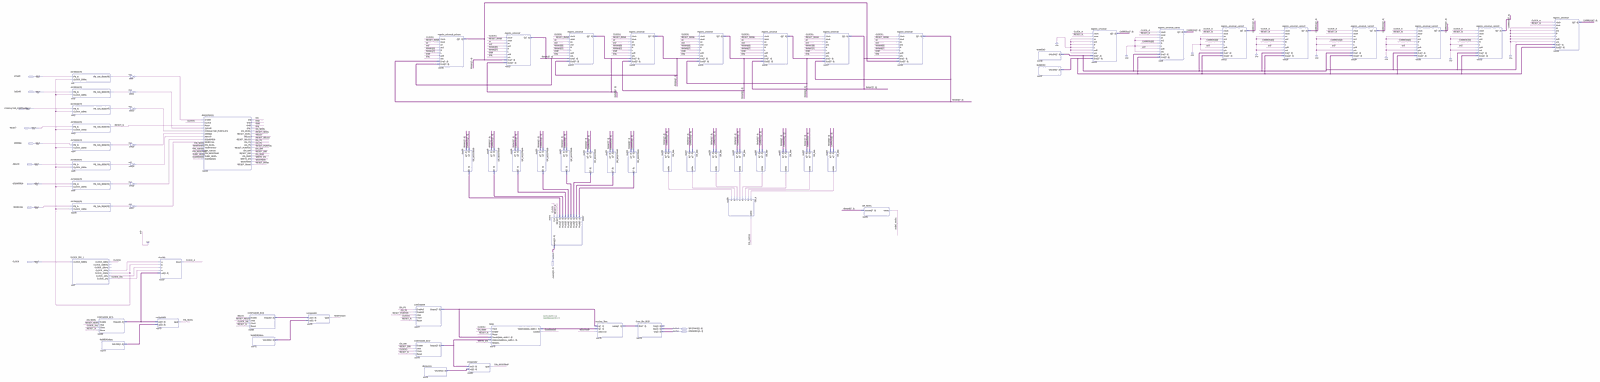
[diagram p0: schematic sheet, whole]
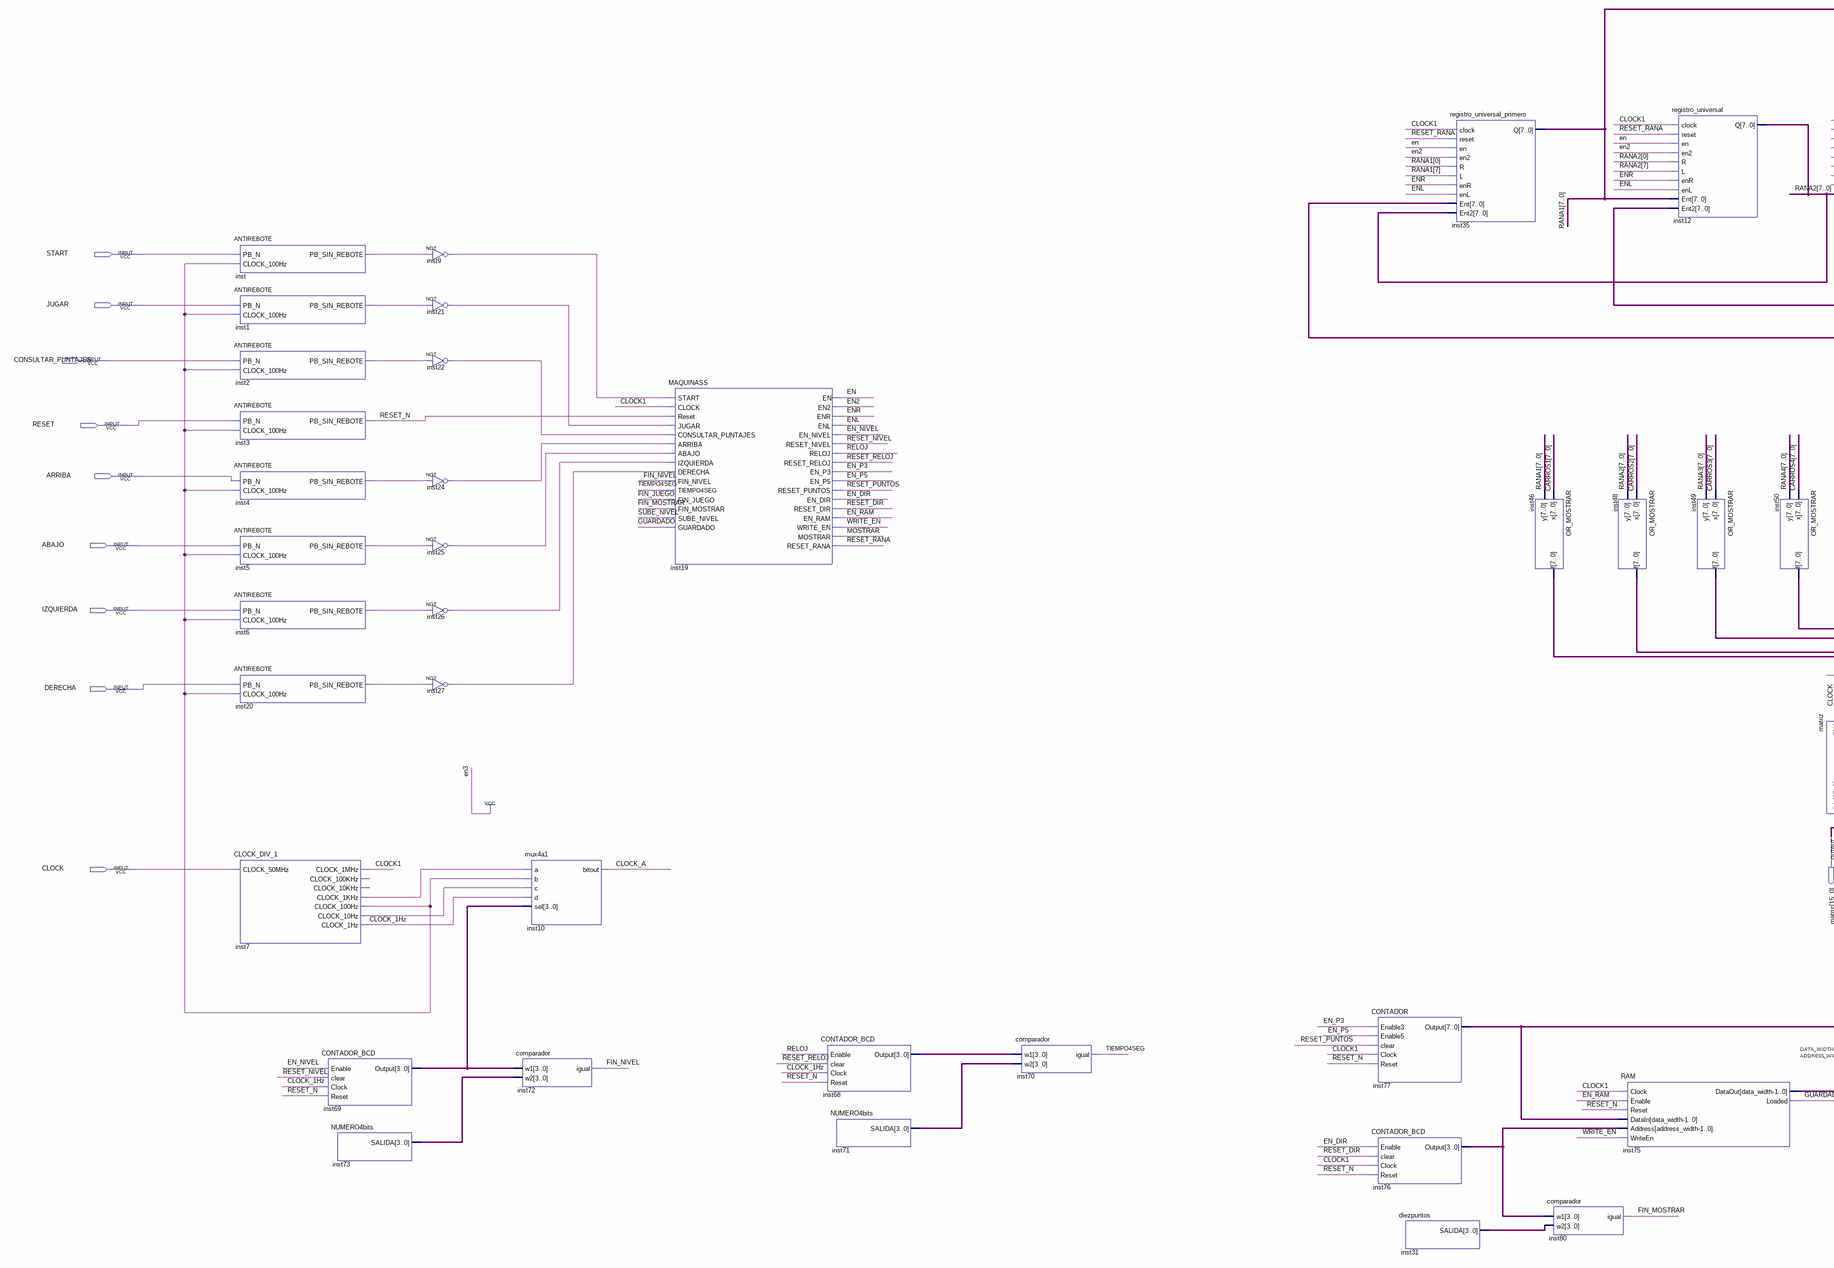
[diagram p1: schematic sheet, left part]
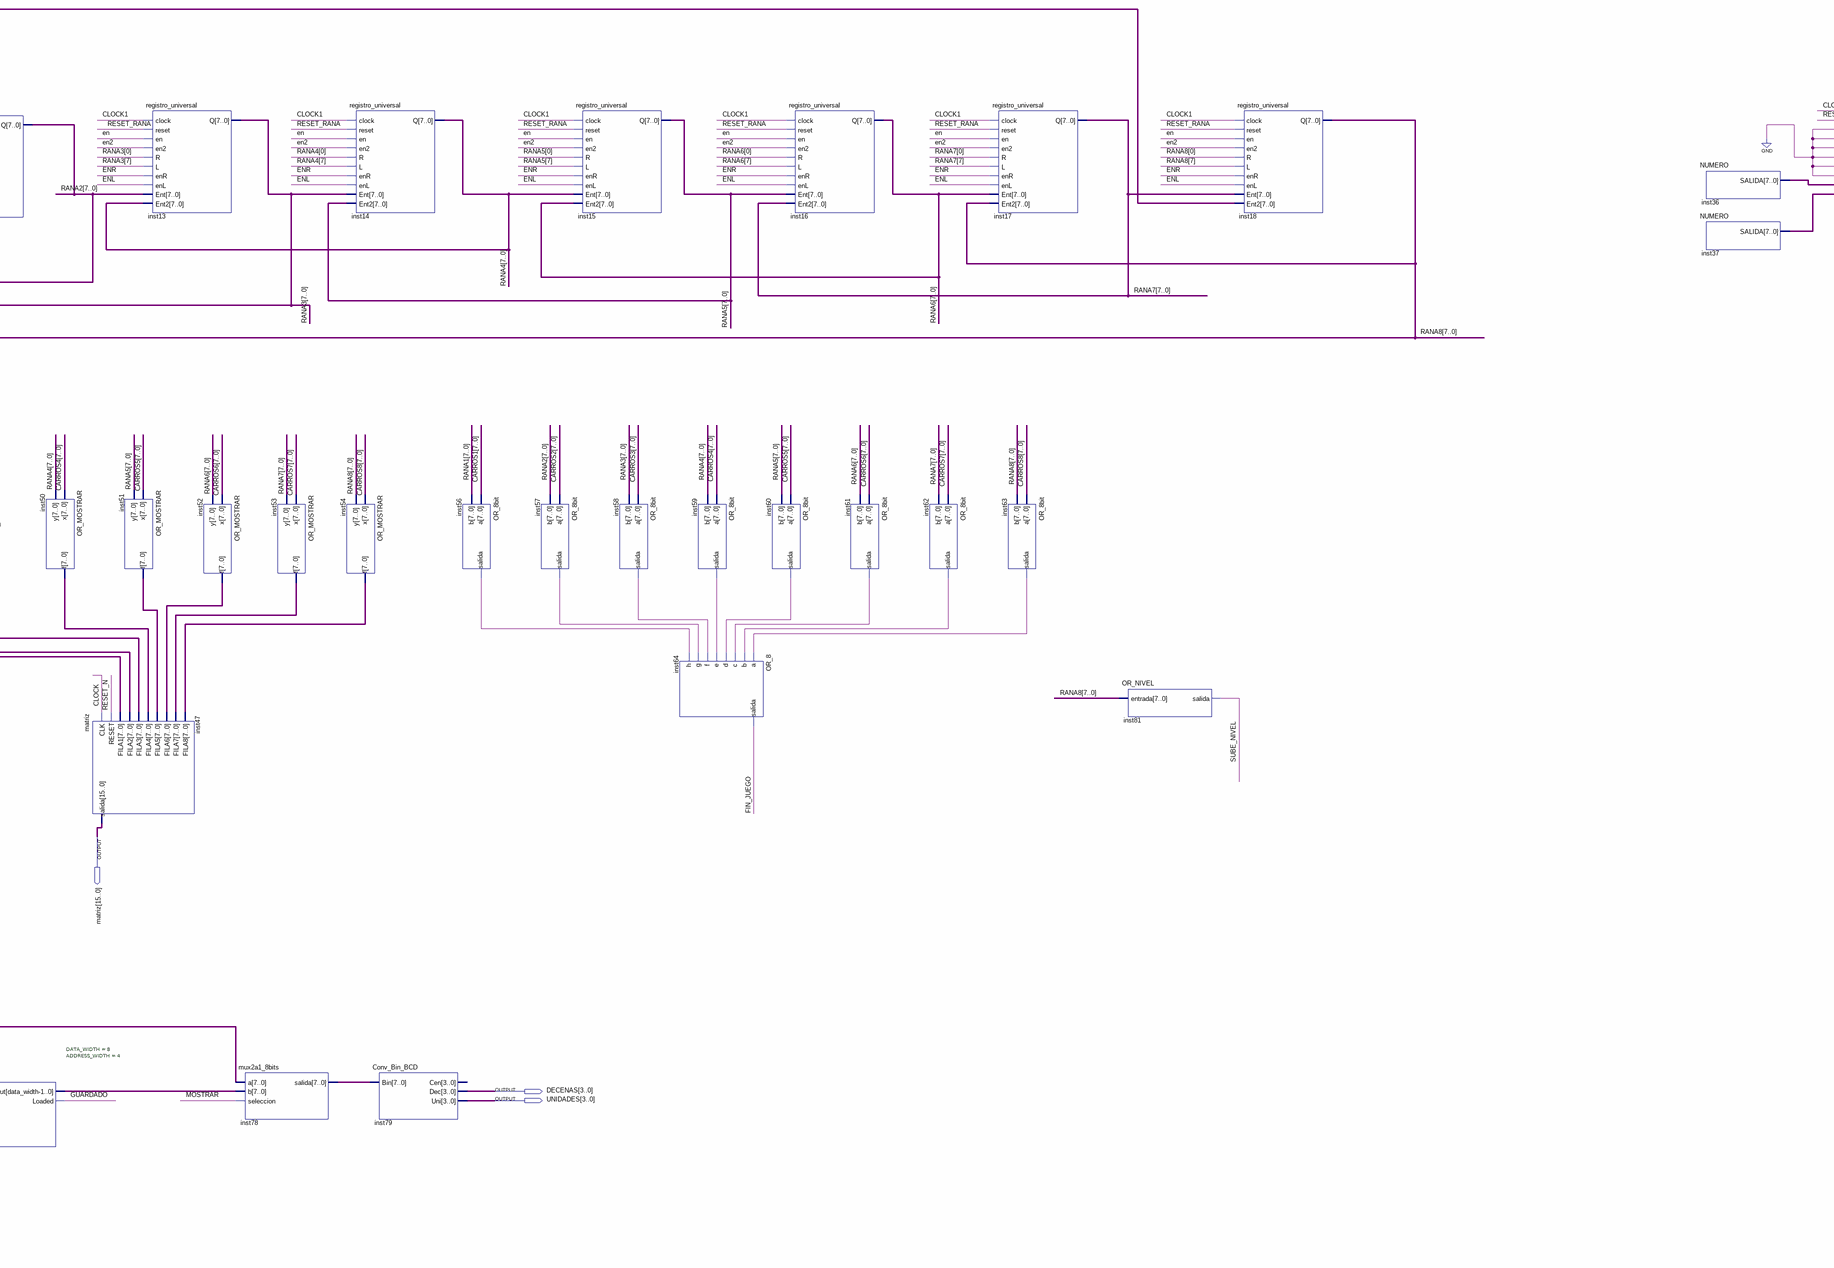
[diagram p2: schematic sheet, centre part]
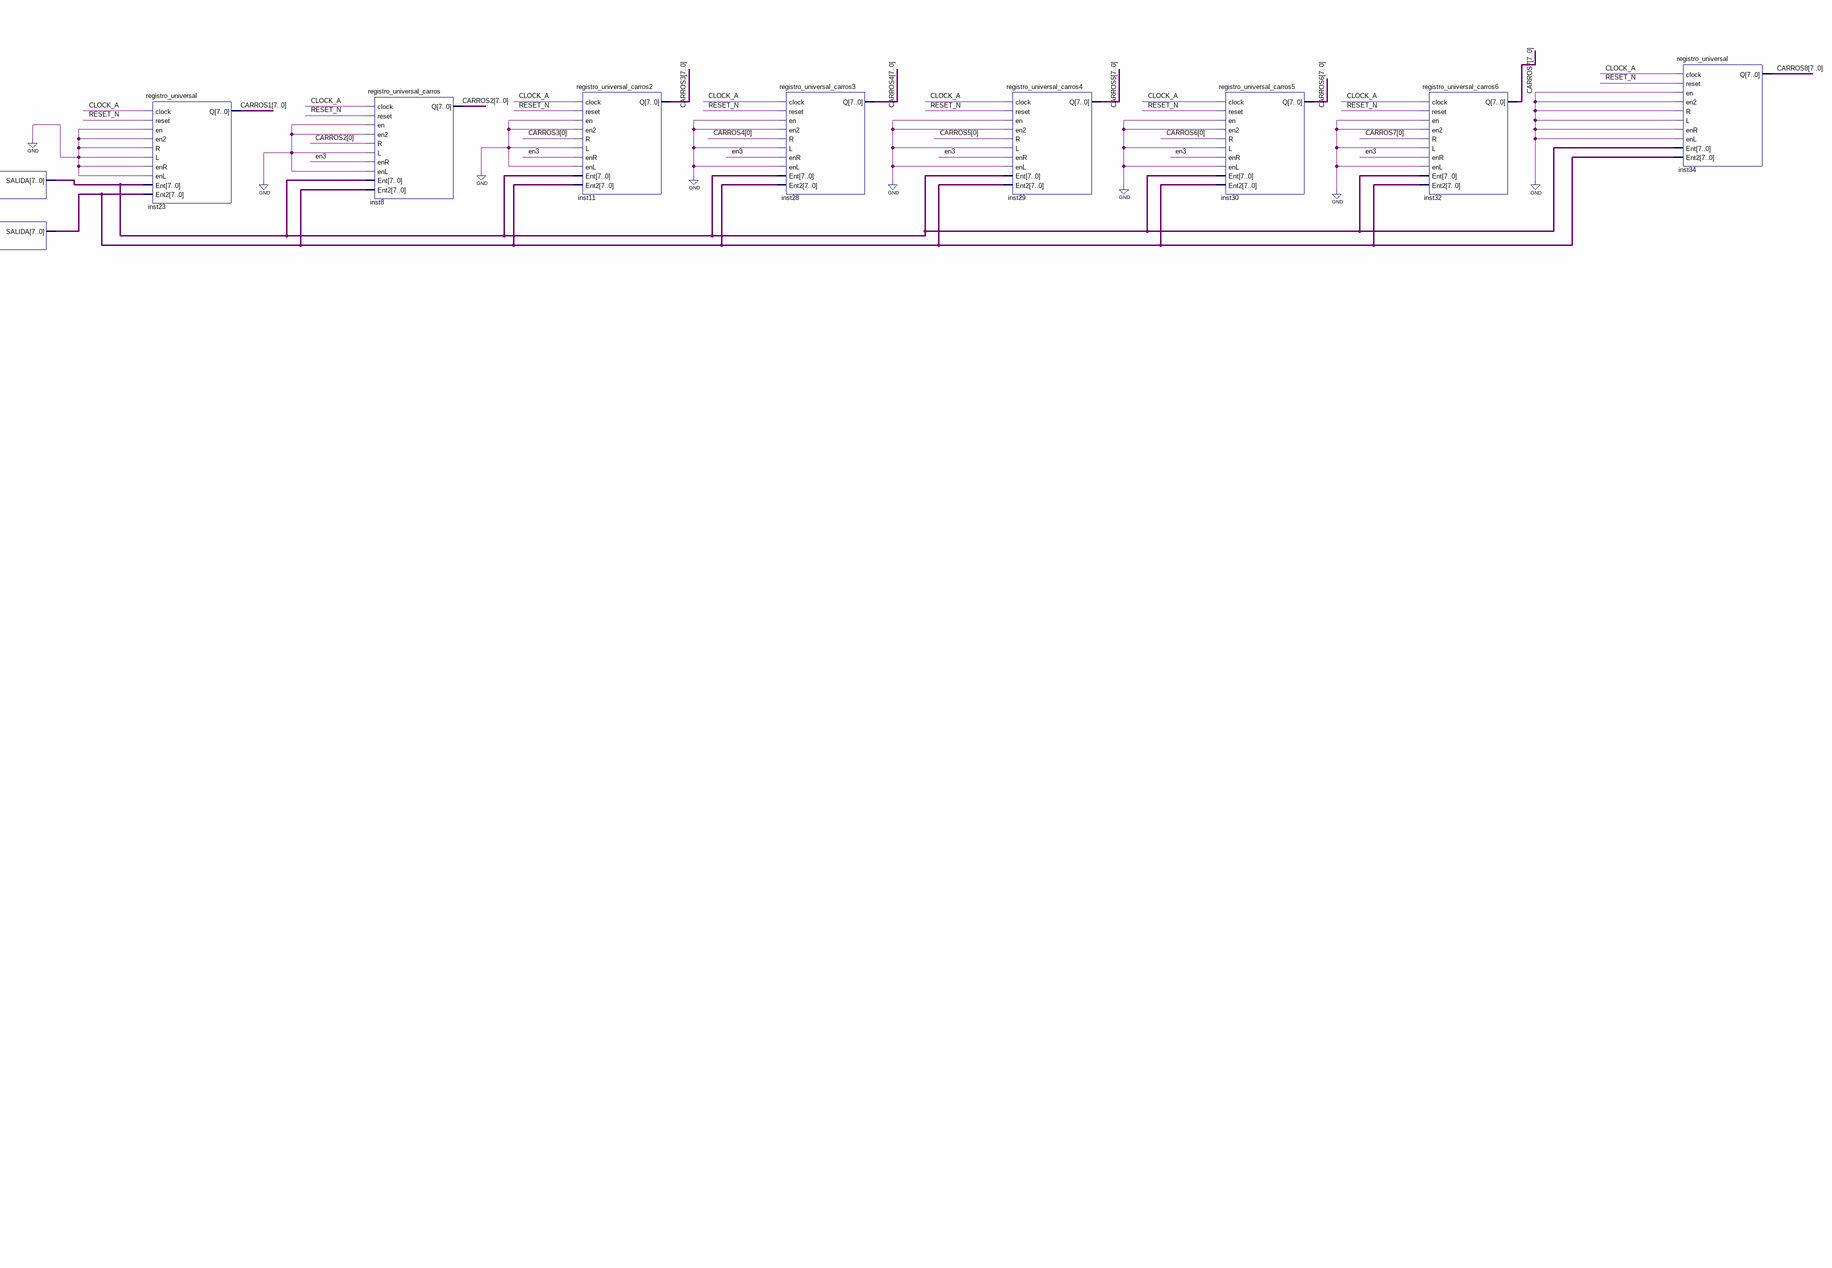
[diagram p3: schematic sheet, right part]
// Quartus schematic brick_games.bdf as structural Verilog: 68 symbols, 12 pins
module brick_games (
  input  START,
  input  JUGAR,
  input  CONSULTAR_PUNTAJES,
  input  RESET,
  input  ARRIBA,
  input  ABAJO,
  input  IZQUIERDA,
  input  DERECHA,
  input  CLOCK,
  output [15:0] matriz,
  output [3:0] DECENAS,
  output [3:0] UNIDADES
);

  wire CLOCK1, CLOCK_1Hz, CLOCK_A, en, en2, EN_DIR, EN_NIVEL, EN_P3, EN_P5, EN_RAM, ENL, ENR, FIN_JUEGO,
       FIN_MOSTRAR, FIN_NIVEL, GUARDADO, inst1_pb_sin_rebote, inst2_pb_sin_rebote, inst4_pb_sin_rebote,
       inst5_pb_sin_rebote, inst6_pb_sin_rebote, inst7_clock_1khz, inst7_clock_10hz, inst7_clock_100hz,
       inst9_out, inst20_pb_sin_rebote, inst21_out, inst22_out, inst24_out, inst25_out, inst26_out,
       inst27_out, inst56_salida, inst57_salida, inst58_salida, inst59_salida, inst60_salida, inst61_salida,
       inst62_salida, inst63_salida, inst_pb_sin_rebote, MOSTRAR, RELOJ, RESET_DIR, RESET_N, RESET_NIVEL,
       RESET_PUNTOS, RESET_RANA, RESET_RELOJ, SUBE_NIVEL, TIEMPO4SEG, WRITE_EN;
  wire [3:0] inst31_salida, inst68_output, inst69_output, inst71_salida, inst73_salida, inst76_output;
  wire [7:0] CARROS1, CARROS2, CARROS3, CARROS4, CARROS5, CARROS6, CARROS7, CARROS8, inst36_salida,
       inst37_salida, inst46_f, inst48_f, inst49_f, inst50_f, inst51_f, inst52_f, inst53_f, inst54_f,
       inst75_dataout, inst77_output, inst78_salida, RANA1, RANA2, RANA3, RANA4, RANA5, RANA6, RANA7, RANA8;

  ANTIREBOTE inst (.PB_N(START), .CLOCK_100Hz(inst7_clock_100hz), .PB_SIN_REBOTE(inst_pb_sin_rebote));
  ANTIREBOTE inst1 (.PB_N(JUGAR), .CLOCK_100Hz(inst7_clock_100hz), .PB_SIN_REBOTE(inst1_pb_sin_rebote));
  ANTIREBOTE inst2 (.PB_N(CONSULTAR_PUNTAJES), .CLOCK_100Hz(inst7_clock_100hz), .PB_SIN_REBOTE(inst2_pb_sin_rebote));
  ANTIREBOTE inst3 (.PB_N(RESET), .CLOCK_100Hz(inst7_clock_100hz), .PB_SIN_REBOTE(RESET_N));
  ANTIREBOTE inst4 (.PB_N(ARRIBA), .CLOCK_100Hz(inst7_clock_100hz), .PB_SIN_REBOTE(inst4_pb_sin_rebote));
  ANTIREBOTE inst5 (.PB_N(ABAJO), .CLOCK_100Hz(inst7_clock_100hz), .PB_SIN_REBOTE(inst5_pb_sin_rebote));
  ANTIREBOTE inst6 (.PB_N(IZQUIERDA), .CLOCK_100Hz(inst7_clock_100hz), .PB_SIN_REBOTE(inst6_pb_sin_rebote));
  ANTIREBOTE inst20 (.PB_N(DERECHA), .CLOCK_100Hz(inst7_clock_100hz), .PB_SIN_REBOTE(inst20_pb_sin_rebote));
  CLOCK_DIV_1 inst7 (
    .CLOCK_50MHz(CLOCK), .CLOCK_1MHz(CLOCK1), .CLOCK_1KHz(inst7_clock_1khz), .CLOCK_100Hz(inst7_clock_100hz),
    .CLOCK_10Hz(inst7_clock_10hz), .CLOCK_1Hz(CLOCK_1Hz));  // open: CLOCK_100KHz, CLOCK_10KHz
  CONTADOR_BCD inst69 (
    .Enable(EN_NIVEL), .clear(RESET_NIVEL), .Clock(CLOCK_1Hz), .Reset(RESET_N), .Output(inst69_output));
  NUMERO4bits inst73 (.SALIDA(inst73_salida));
  not inst9 (inst9_out, inst_pb_sin_rebote);
  not inst21 (inst21_out, inst1_pb_sin_rebote);
  not inst22 (inst22_out, inst2_pb_sin_rebote);
  not inst24 (inst24_out, inst4_pb_sin_rebote);
  not inst25 (inst25_out, inst5_pb_sin_rebote);
  not inst26 (inst26_out, inst6_pb_sin_rebote);
  not inst27 (inst27_out, inst20_pb_sin_rebote);
  mux4a1 inst10 (
    .a(inst7_clock_1khz), .b(inst7_clock_100hz), .c(inst7_clock_10hz), .d(CLOCK_1Hz), .sel(inst69_output),
    .bitout(CLOCK_A));
  comparador inst72 (.w1(inst69_output), .w2(inst73_salida), .igual(FIN_NIVEL));
  MAQUINASS inst19 (
    .START(inst9_out), .CLOCK(CLOCK1), .Reset(RESET_N), .JUGAR(inst21_out), .CONSULTAR_PUNTAJES(inst22_out),
    .ARRIBA(inst24_out), .ABAJO(inst25_out), .IZQUIERDA(inst26_out), .DERECHA(inst27_out),
    .FIN_NIVEL(FIN_NIVEL), .TIEMPO4SEG(TIEMPO4SEG), .FIN_JUEGO(FIN_JUEGO), .FIN_MOSTRAR(FIN_MOSTRAR),
    .SUBE_NIVEL(SUBE_NIVEL), .GUARDADO(GUARDADO), .EN(en), .EN2(en2), .ENR(ENR), .ENL(ENL),
    .EN_NIVEL(EN_NIVEL), .RESET_NIVEL(RESET_NIVEL), .RELOJ(RELOJ), .RESET_RELOJ(RESET_RELOJ), .EN_P3(EN_P3),
    .EN_P5(EN_P5), .RESET_PUNTOS(RESET_PUNTOS), .EN_DIR(EN_DIR), .RESET_DIR(RESET_DIR), .EN_RAM(EN_RAM),
    .WRITE_EN(WRITE_EN), .MOSTRAR(MOSTRAR), .RESET_RANA(RESET_RANA));
  CONTADOR_BCD inst68 (.Enable(RELOJ), .clear(RESET_RELOJ), .Clock(CLOCK_1Hz), .Reset(RESET_N), .Output(inst68_output));
  NUMERO4bits inst71 (.SALIDA(inst71_salida));
  comparador inst70 (.w1(inst68_output), .w2(inst71_salida), .igual(TIEMPO4SEG));
  CONTADOR inst77 (
    .Enable3(EN_P3), .Enable5(EN_P5), .clear(RESET_PUNTOS), .Clock(CLOCK1), .Reset(RESET_N),
    .Output(inst77_output));
  CONTADOR_BCD inst76 (.Enable(EN_DIR), .clear(RESET_DIR), .Clock(CLOCK1), .Reset(RESET_N), .Output(inst76_output));
  diezpuntos inst31 (.SALIDA(inst31_salida));
  registro_universal_primero inst35 (
    .clock(CLOCK1), .reset(RESET_RANA), .en(en), .en2(en2), .R(RANA1[0]), .L(RANA1[7]), .enR(ENR), .enL(ENL),
    .Ent(RANA8), .Ent2(RANA2), .Q(RANA1));
  OR_MOSTRAR inst46 (.x(CARROS1), .y(RANA1), .f(inst46_f));
  comparador inst80 (.w1(inst76_output), .w2(inst31_salida), .igual(FIN_MOSTRAR));
  OR_MOSTRAR inst48 (.x(CARROS2), .y(RANA2), .f(inst48_f));
  RAM #(.DATA_WIDTH(8), .ADDRESS_WIDTH(4)) inst75 (
    .Clock(CLOCK1), .Enable(EN_RAM), .Reset(RESET_N), .DataIn(inst77_output), .Address(inst76_output),
    .WriteEn(WRITE_EN), .DataOut(inst75_dataout), .Loaded(GUARDADO));
  registro_universal inst12 (
    .clock(CLOCK1), .reset(RESET_RANA), .en(en), .en2(en2), .R(RANA2[0]), .L(RANA2[7]), .enR(ENR), .enL(ENL),
    .Ent(RANA1), .Ent2(RANA3), .Q(RANA2));
  OR_MOSTRAR inst49 (.x(CARROS3), .y(RANA3), .f(inst49_f));
  OR_MOSTRAR inst50 (.x(CARROS4), .y(RANA4), .f(inst50_f));
  matriz inst47 (
    .CLK(CLOCK), .RESET(RESET_N), .FILA1(inst46_f), .FILA2(inst48_f), .FILA3(inst49_f), .FILA4(inst50_f),
    .FILA5(inst51_f), .FILA6(inst52_f), .FILA7(inst53_f), .FILA8(inst54_f), .salida(matriz));
  registro_universal inst13 (
    .clock(CLOCK1), .reset(RESET_RANA), .en(en), .en2(en2), .R(RANA3[0]), .L(RANA3[7]), .enR(ENR), .enL(ENL),
    .Ent(RANA2), .Ent2(RANA4), .Q(RANA3));
  OR_MOSTRAR inst51 (.x(CARROS5), .y(RANA5), .f(inst51_f));
  OR_MOSTRAR inst52 (.x(CARROS6), .y(RANA6), .f(inst52_f));
  mux2a1_8bits inst78 (.a(inst77_output), .b(inst75_dataout), .seleccion(MOSTRAR), .salida(inst78_salida));
  OR_MOSTRAR inst53 (.x(CARROS7), .y(RANA7), .f(inst53_f));
  registro_universal inst14 (
    .clock(CLOCK1), .reset(RESET_RANA), .en(en), .en2(en2), .R(RANA4[0]), .L(RANA4[7]), .enR(ENR), .enL(ENL),
    .Ent(RANA3), .Ent2(RANA5), .Q(RANA4));
  OR_MOSTRAR inst54 (.x(CARROS8), .y(RANA8), .f(inst54_f));
  Conv_Bin_BCD inst79 (.Bin(inst78_salida), .Dec(DECENAS), .Uni(UNIDADES));  // open: Cen
  OR_8bit inst56 (.a(CARROS1), .b(RANA1), .salida(inst56_salida));
  OR_8bit inst57 (.a(CARROS2), .b(RANA2), .salida(inst57_salida));
  registro_universal inst15 (
    .clock(CLOCK1), .reset(RESET_RANA), .en(en), .en2(en2), .R(RANA5[0]), .L(RANA5[7]), .enR(ENR), .enL(ENL),
    .Ent(RANA4), .Ent2(RANA6), .Q(RANA5));
  OR_8bit inst58 (.a(CARROS3), .b(RANA3), .salida(inst58_salida));
  OR_8bit inst59 (.a(CARROS4), .b(RANA4), .salida(inst59_salida));
  OR_8 inst64 (
    .a(inst63_salida), .b(inst62_salida), .c(inst61_salida), .d(inst60_salida), .e(inst59_salida),
    .f(inst58_salida), .g(inst57_salida), .h(inst56_salida), .salida(FIN_JUEGO));
  OR_8bit inst60 (.a(CARROS5), .b(RANA5), .salida(inst60_salida));
  registro_universal inst16 (
    .clock(CLOCK1), .reset(RESET_RANA), .en(en), .en2(en2), .R(RANA6[0]), .L(RANA6[7]), .enR(ENR), .enL(ENL),
    .Ent(RANA5), .Ent2(RANA7), .Q(RANA6));
  OR_8bit inst61 (.a(CARROS6), .b(RANA6), .salida(inst61_salida));
  OR_8bit inst62 (.a(CARROS7), .b(RANA7), .salida(inst62_salida));
  registro_universal inst17 (
    .clock(CLOCK1), .reset(RESET_RANA), .en(en), .en2(en2), .R(RANA7[0]), .L(RANA7[7]), .enR(ENR), .enL(ENL),
    .Ent(RANA6), .Ent2(RANA8), .Q(RANA7));
  OR_8bit inst63 (.a(CARROS8), .b(RANA8), .salida(inst63_salida));
  OR_NIVEL inst81 (.entrada(RANA8), .salida(SUBE_NIVEL));
  registro_universal inst18 (
    .clock(CLOCK1), .reset(RESET_RANA), .en(en), .en2(en2), .R(RANA8[0]), .L(RANA8[7]), .enR(ENR), .enL(ENL),
    .Ent(RANA7), .Ent2(RANA1), .Q(RANA8));
  NUMERO inst36 (.SALIDA(inst36_salida));
  NUMERO inst37 (.SALIDA(inst37_salida));
  registro_universal inst23 (
    .clock(CLOCK_A), .reset(RESET_N), .en(1'b0), .en2(1'b0), .R(1'b0), .L(1'b0), .enR(1'b0), .enL(1'b0),
    .Ent(inst36_salida), .Ent2(inst37_salida), .Q(CARROS1));
  registro_universal_carros inst8 (
    .clock(CLOCK_A), .reset(RESET_N), .en(1'b0), .en2(1'b0), .R(CARROS2[0]), .L(1'b0), .enR(1'b1),
    .enL(1'b0), .Ent(inst36_salida), .Ent2(inst37_salida), .Q(CARROS2));
  registro_universal_carros2 inst11 (
    .clock(CLOCK_A), .reset(RESET_N), .en(1'b0), .en2(1'b0), .R(CARROS3[0]), .L(1'b0), .enR(1'b1),
    .enL(1'b0), .Ent(inst36_salida), .Ent2(inst37_salida), .Q(CARROS3));
  registro_universal_carros3 inst28 (
    .clock(CLOCK_A), .reset(RESET_N), .en(1'b0), .en2(1'b0), .R(CARROS4[0]), .L(1'b0), .enR(1'b1),
    .enL(1'b0), .Ent(inst36_salida), .Ent2(inst37_salida), .Q(CARROS4));
  registro_universal_carros4 inst29 (
    .clock(CLOCK_A), .reset(RESET_N), .en(1'b0), .en2(1'b0), .R(CARROS5[0]), .L(1'b0), .enR(1'b1),
    .enL(1'b0), .Ent(inst36_salida), .Ent2(inst37_salida), .Q(CARROS5));
  registro_universal_carros5 inst30 (
    .clock(CLOCK_A), .reset(RESET_N), .en(1'b0), .en2(1'b0), .R(CARROS6[0]), .L(1'b0), .enR(1'b1),
    .enL(1'b0), .Ent(inst36_salida), .Ent2(inst37_salida), .Q(CARROS6));
  registro_universal_carros6 inst32 (
    .clock(CLOCK_A), .reset(RESET_N), .en(1'b0), .en2(1'b0), .R(CARROS7[0]), .L(1'b0), .enR(1'b1),
    .enL(1'b0), .Ent(inst36_salida), .Ent2(inst37_salida), .Q(CARROS7));
  registro_universal inst34 (
    .clock(CLOCK_A), .reset(RESET_N), .en(1'b0), .en2(1'b0), .R(1'b0), .L(1'b0), .enR(1'b0), .enL(1'b0),
    .Ent(inst36_salida), .Ent2(inst37_salida), .Q(CARROS8));
endmodule
